# Altium schematic sheet RT9187.SchDoc
size A4; SheetNumber: 1; SheetTotal: 1
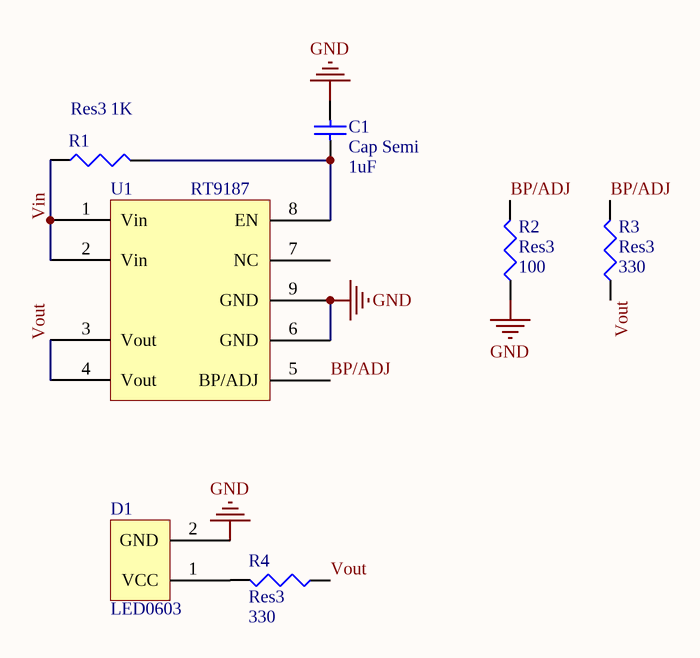
[diagram p0: RT9187.SchDoc]

## Parts
C1  Cap Semi  value 1uF  [1608[0603]]
D1  LED0603  [LED0603]
R1  Res3  value 1K  [J1-0603]
R2  Res3  value 100  [J1-0603]
R3  Res3  value 330  [J1-0603]
R4  Res3  value 330  [J1-0603]
U1  RT9187  [RT9187]

## Nets
GND: C1.1 D1.2(GND) R2.1 U1.6(GND) U1.9(GND)
BP/ADJ: R2.2 R3.2 U1.5(BP/ADJ)
Vin: R1.1 U1.1(Vin) U1.2(Vin)
Vout: R3.1 R4.1 U1.3(Vout) U1.4(Vout)
NetC1_2: C1.2 R1.2 U1.8(EN)
NetD1_1: D1.1(VCC) R4.2

Not connected (* = marked no-connect by the designer): U1 7(NC)

## Library data of the parts
C1 = Cap Semi: Capacitor (Semiconductor SIM Model); Published: 8-Jun-2000; LatestRevisionDate: 29-May-2009; LatestRevisionNote: IPC-7351 Footprint Added.; PackageReference: C1206; Publisher: Altium Limited; PackageDescription: Chip Capacitor
R1-R4 = Res3: Resistor; Published: 8-Jun-2000; LatestRevisionDate: 29-May-2009; LatestRevisionNote: IPC-7351 Footprint Added.; PackageReference: J1-0603; Publisher: Altium Limited; PackageDescription: Chip Resistor